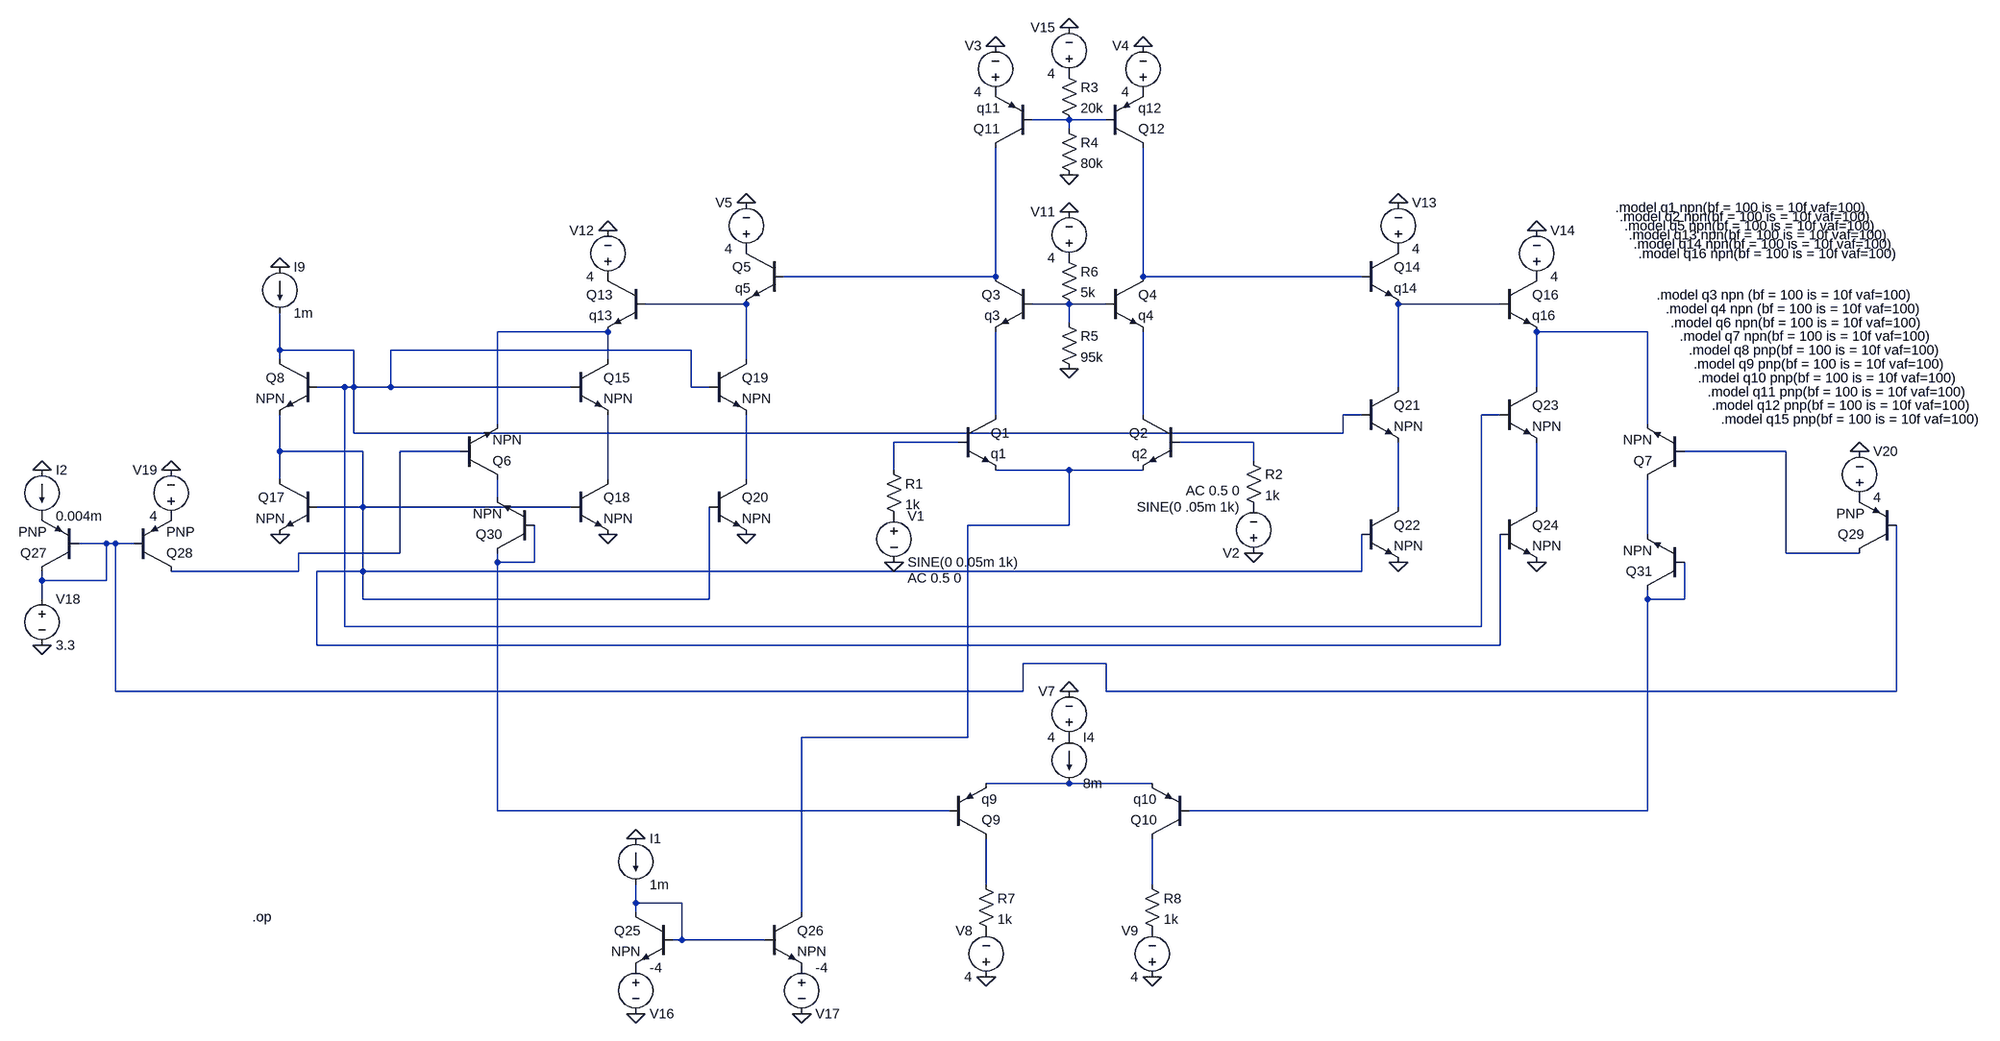
[diagram p0: schematic part_b.asc]
part_b.asc, the LTspice schematic file:
Version 4
SHEET 1 1848 1604
WIRE 128 -288 64 -288
WIRE 192 -288 128 -288
WIRE 128 -272 128 -288
WIRE 0 -16 0 -240
WIRE 0 -16 -368 -16
WIRE 256 -16 256 -240
WIRE 720 -16 256 -16
WIRE -432 32 -608 32
WIRE 128 32 64 32
WIRE 192 32 128 32
WIRE 960 32 784 32
WIRE 128 64 128 32
WIRE -672 80 -864 80
WIRE 1216 80 1024 80
WIRE -1296 112 -1296 48
WIRE -1168 112 -1296 112
WIRE -528 112 -1104 112
WIRE -1296 128 -1296 112
WIRE -672 128 -672 80
WIRE -432 128 -432 32
WIRE -1184 176 -1232 176
WIRE -1168 176 -1168 112
WIRE -1168 176 -1184 176
WIRE -1104 176 -1104 112
WIRE -1104 176 -1168 176
WIRE -736 176 -1104 176
WIRE -528 176 -528 112
WIRE -496 176 -528 176
WIRE 784 176 784 32
WIRE 1024 176 1024 80
WIRE 0 224 0 80
WIRE 256 224 256 80
WIRE 720 224 688 224
WIRE 960 224 928 224
WIRE -864 240 -864 80
WIRE 1216 240 1216 80
WIRE -1168 256 -1168 176
WIRE 688 256 688 224
WIRE 688 256 -1168 256
WIRE -64 272 -176 272
WIRE 448 272 320 272
WIRE -1296 288 -1296 224
WIRE -1152 288 -1296 288
WIRE -928 288 -1088 288
WIRE 1456 288 1280 288
WIRE 448 304 448 272
WIRE -176 320 -176 272
WIRE 128 320 0 320
WIRE 256 320 128 320
WIRE -1296 336 -1296 288
WIRE -672 336 -672 224
WIRE -432 336 -432 224
WIRE -864 368 -864 336
WIRE -1152 384 -1152 288
WIRE -1152 384 -1232 384
WIRE -736 384 -1152 384
WIRE 784 384 784 272
WIRE 1024 384 1024 272
WIRE 128 416 128 320
WIRE 128 416 -48 416
WIRE 1216 432 1216 336
WIRE -1632 448 -1680 448
WIRE -1616 448 -1632 448
WIRE -1584 448 -1616 448
WIRE -1088 464 -1088 288
WIRE -1088 464 -1264 464
WIRE 1456 464 1456 288
WIRE 1584 464 1456 464
WIRE -864 480 -864 464
WIRE -800 480 -800 416
WIRE -800 480 -864 480
WIRE -1264 496 -1264 464
WIRE -1264 496 -1520 496
WIRE -1152 496 -1152 384
WIRE -1152 496 -1232 496
WIRE 720 496 720 432
WIRE 720 496 -1152 496
WIRE -1744 512 -1744 496
WIRE -1632 512 -1632 448
WIRE -1632 512 -1744 512
WIRE -1744 544 -1744 512
WIRE -1152 544 -1152 496
WIRE -496 544 -496 384
WIRE -496 544 -1152 544
WIRE 1216 544 1216 528
WIRE 1280 544 1280 480
WIRE 1280 544 1216 544
WIRE -1184 592 -1184 176
WIRE 928 592 928 224
WIRE 928 592 -1184 592
WIRE -1232 624 -1232 496
WIRE 960 624 960 432
WIRE 960 624 -1232 624
WIRE 192 656 48 656
WIRE -1616 704 -1616 448
WIRE 48 704 48 656
WIRE 48 704 -1616 704
WIRE 192 704 192 656
WIRE 1648 704 1648 416
WIRE 1648 704 192 704
WIRE -48 784 -48 416
WIRE -48 784 -336 784
WIRE 128 864 -16 864
WIRE 272 864 128 864
WIRE -864 912 -864 480
WIRE -80 912 -864 912
WIRE 1216 912 1216 544
WIRE 1216 912 336 912
WIRE -16 1040 -16 960
WIRE 272 1040 272 960
WIRE -624 1072 -624 1040
WIRE -544 1072 -624 1072
WIRE -624 1088 -624 1072
WIRE -336 1088 -336 784
WIRE -544 1136 -544 1072
WIRE -544 1136 -560 1136
WIRE -400 1136 -544 1136
FLAG 256 -416 0
FLAG 0 -416 0
FLAG -432 -144 0
FLAG -16 1200 0
FLAG 272 1200 0
FLAG -672 -96 0
FLAG 784 -144 0
FLAG 1024 -96 0
FLAG 128 -192 0
FLAG 128 -128 0
FLAG 128 144 0
FLAG 128 -448 0
FLAG -176 480 0
FLAG 448 464 0
FLAG -1296 -32 0
FLAG -1296 432 0
FLAG -672 432 0
FLAG -432 432 0
FLAG 784 480 0
FLAG 1024 480 0
FLAG -624 960 0
FLAG -624 1264 0
FLAG -336 1264 0
FLAG -1744 320 0
FLAG -1520 320 0
FLAG -1744 624 0
FLAG 1584 288 0
FLAG 128 704 0
DATAFLAG -208 912 ""
DATAFLAG -16 992 ""
DATAFLAG 272 1008 ""
DATAFLAG 96 864 ""
DATAFLAG 96 320 ""
DATAFLAG -336 1008 ""
DATAFLAG -480 1136 ""
DATAFLAG -1440 496 ""
DATAFLAG -1616 448 ""
DATAFLAG 1504 464 ""
DATAFLAG 1680 416 ""
SYMBOL res -192 304 R0
SYMATTR InstName R1
SYMATTR Value 1k
SYMBOL res 432 288 R0
SYMATTR InstName R2
SYMATTR Value 1k
SYMBOL npn -64 224 R0
SYMATTR InstName Q1
SYMATTR Value q1
SYMBOL npn 320 224 M0
SYMATTR InstName Q2
SYMATTR Value q2
SYMBOL voltage 0 -320 R180
WINDOW 0 24 96 Left 2
WINDOW 3 24 16 Left 2
WINDOW 123 0 0 Left 0
WINDOW 39 0 0 Left 0
SYMATTR InstName V3
SYMATTR Value 4
SYMBOL voltage 256 -320 R180
WINDOW 0 24 96 Left 2
WINDOW 3 24 16 Left 2
WINDOW 123 0 0 Left 0
WINDOW 39 0 0 Left 0
SYMATTR InstName V4
SYMATTR Value 4
SYMBOL npn -368 -64 M0
SYMATTR InstName Q5
SYMATTR Value q5
SYMBOL voltage -432 -48 R180
WINDOW 0 24 96 Left 2
WINDOW 3 24 16 Left 2
WINDOW 123 0 0 Left 0
WINDOW 39 0 0 Left 0
SYMATTR InstName V5
SYMATTR Value 4
SYMBOL current 128 784 R0
WINDOW 123 0 0 Left 0
WINDOW 39 0 0 Left 0
SYMATTR InstName I4
SYMATTR Value 8m
SYMBOL pnp -80 960 M180
SYMATTR InstName Q9
SYMATTR Value q9
SYMBOL pnp 336 960 R180
SYMATTR InstName Q10
SYMATTR Value q10
SYMBOL res -32 1024 R0
SYMATTR InstName R7
SYMATTR Value 1k
SYMBOL res 256 1024 R0
SYMATTR InstName R8
SYMATTR Value 1k
SYMBOL voltage -16 1216 R180
WINDOW 0 24 96 Left 2
WINDOW 3 24 16 Left 2
WINDOW 123 0 0 Left 0
WINDOW 39 0 0 Left 0
SYMATTR InstName V8
SYMATTR Value 4
SYMBOL voltage 272 1216 R180
WINDOW 0 24 96 Left 2
WINDOW 3 24 16 Left 2
WINDOW 123 0 0 Left 0
WINDOW 39 0 0 Left 0
SYMATTR InstName V9
SYMATTR Value 4
SYMBOL pnp 64 -240 R180
SYMATTR InstName Q11
SYMATTR Value q11
SYMBOL pnp 192 -240 M180
SYMATTR InstName Q12
SYMATTR Value q12
SYMBOL npn -608 -16 M0
SYMATTR InstName Q13
SYMATTR Value q13
SYMBOL voltage -672 0 R180
WINDOW 0 24 96 Left 2
WINDOW 3 24 16 Left 2
WINDOW 123 0 0 Left 0
WINDOW 39 0 0 Left 0
SYMATTR InstName V12
SYMATTR Value 4
SYMBOL npn 720 -64 R0
SYMATTR InstName Q14
SYMATTR Value q14
SYMBOL voltage 784 -48 M180
WINDOW 0 24 96 Left 2
WINDOW 3 24 16 Left 2
WINDOW 123 0 0 Left 0
WINDOW 39 0 0 Left 0
SYMATTR InstName V13
SYMATTR Value 4
SYMBOL npn 960 -16 R0
SYMATTR InstName Q16
SYMATTR Value q16
SYMBOL voltage 1024 0 M180
WINDOW 0 24 96 Left 2
WINDOW 3 24 16 Left 2
WINDOW 123 0 0 Left 0
WINDOW 39 0 0 Left 0
SYMATTR InstName V14
SYMATTR Value 4
SYMBOL res 112 -384 R0
SYMATTR InstName R3
SYMATTR Value 20k
SYMBOL res 112 -288 R0
SYMATTR InstName R4
SYMATTR Value 80k
SYMBOL res 112 48 R0
SYMATTR InstName R5
SYMATTR Value 95k
SYMBOL res 112 -64 R0
SYMATTR InstName R6
SYMATTR Value 5k
SYMBOL voltage 128 -32 R180
WINDOW 0 24 96 Left 2
WINDOW 3 24 16 Left 2
WINDOW 123 0 0 Left 0
WINDOW 39 0 0 Left 0
SYMATTR InstName V11
SYMATTR Value 4
SYMBOL voltage 128 -352 R180
WINDOW 0 24 96 Left 2
WINDOW 3 24 16 Left 2
SYMATTR InstName V15
SYMATTR Value 4
SYMBOL npn 64 -16 M0
SYMATTR InstName Q3
SYMATTR Value q3
SYMBOL npn 192 -16 R0
SYMATTR InstName Q4
SYMATTR Value q4
SYMBOL npn -928 336 M180
SYMATTR InstName Q6
SYMBOL npn 1280 336 R180
SYMATTR InstName Q7
SYMBOL voltage -176 384 R0
WINDOW 123 24 124 Left 2
WINDOW 39 0 0 Left 0
SYMATTR Value2 AC 0.5 0
SYMATTR InstName V1
SYMATTR Value SINE(0 0.05m 1k)
SYMBOL voltage 448 480 R180
WINDOW 123 24 124 Left 2
WINDOW 39 0 0 Left 0
SYMATTR Value2 AC 0.5 0
SYMATTR InstName V2
SYMATTR Value SINE(0 .05m 1k)
SYMBOL current -1296 -32 R0
WINDOW 123 0 0 Left 0
WINDOW 39 0 0 Left 0
SYMATTR InstName I9
SYMATTR Value 1m
SYMBOL npn -1232 128 M0
SYMATTR InstName Q8
SYMBOL npn -736 128 R0
SYMATTR InstName Q15
SYMBOL npn -1232 336 M0
SYMATTR InstName Q17
SYMBOL npn -736 336 R0
SYMATTR InstName Q18
SYMBOL npn -496 128 R0
SYMATTR InstName Q19
SYMBOL npn -496 336 R0
SYMATTR InstName Q20
SYMBOL npn 720 176 R0
SYMATTR InstName Q21
SYMBOL npn 720 384 R0
SYMATTR InstName Q22
SYMBOL npn 960 176 R0
SYMATTR InstName Q23
SYMBOL npn 960 384 R0
SYMATTR InstName Q24
SYMBOL current -624 960 R0
WINDOW 123 0 0 Left 0
WINDOW 39 0 0 Left 0
SYMATTR InstName I1
SYMATTR Value 1m
SYMBOL npn -560 1088 M0
SYMATTR InstName Q25
SYMBOL npn -400 1088 R0
SYMATTR InstName Q26
SYMBOL voltage -624 1168 R0
WINDOW 0 24 96 Left 2
WINDOW 3 24 16 Left 2
WINDOW 123 0 0 Left 0
WINDOW 39 0 0 Left 0
SYMATTR InstName V16
SYMATTR Value -4
SYMBOL voltage -336 1168 R0
WINDOW 0 24 96 Left 2
WINDOW 3 24 16 Left 2
WINDOW 123 0 0 Left 0
WINDOW 39 0 0 Left 0
SYMATTR InstName V17
SYMATTR Value -4
SYMBOL pnp -1680 496 R180
SYMATTR InstName Q27
SYMBOL pnp -1584 496 M180
SYMATTR InstName Q28
SYMBOL voltage -1520 416 R180
WINDOW 0 24 96 Left 2
WINDOW 3 24 16 Left 2
WINDOW 123 0 0 Left 0
WINDOW 39 0 0 Left 0
SYMATTR InstName V19
SYMATTR Value 4
SYMBOL current -1744 320 R0
WINDOW 123 0 0 Left 0
WINDOW 39 0 0 Left 0
SYMATTR InstName I2
SYMATTR Value 0.004m
SYMBOL voltage -1744 528 R0
WINDOW 123 0 0 Left 0
WINDOW 39 0 0 Left 0
SYMATTR InstName V18
SYMATTR Value 3.3
SYMBOL pnp 1648 464 R180
SYMATTR InstName Q29
SYMBOL voltage 1584 384 M180
WINDOW 0 24 96 Left 2
WINDOW 3 24 16 Left 2
WINDOW 123 0 0 Left 0
WINDOW 39 0 0 Left 0
SYMATTR InstName V20
SYMATTR Value 4
SYMBOL voltage 128 800 R180
WINDOW 0 24 96 Left 2
WINDOW 3 24 16 Left 2
WINDOW 123 0 0 Left 0
WINDOW 39 0 0 Left 0
SYMATTR InstName V7
SYMATTR Value 4
SYMBOL npn -800 464 R180
SYMATTR InstName Q30
SYMBOL npn 1280 528 R180
SYMATTR InstName Q31
TEXT 1160 -136 Left 2 !.model q1 npn(bf = 100 is = 10f vaf=100)
TEXT 1168 -120 Left 2 !.model q2 npn(bf = 100 is = 10f vaf=100)
TEXT 1176 -104 Left 2 !.model q5 npn(bf = 100 is = 10f vaf=100)
TEXT 1184 -88 Left 2 !.model q13 npn(bf = 100 is = 10f vaf=100)
TEXT 1192 -72 Left 2 !.model q14 npn(bf = 100 is = 10f vaf=100)
TEXT 1200 -56 Left 2 !.model q16 npn(bf = 100 is = 10f vaf=100)
TEXT 1232 16 Left 2 !.model q3 npn (bf = 100 is = 10f vaf=100)
TEXT 1248 40 Left 2 !.model q4 npn (bf = 100 is = 10f vaf=100)
TEXT 1256 64 Left 2 !.model q6 npn(bf = 100 is = 10f vaf=100)
TEXT 1272 88 Left 2 !.model q7 npn(bf = 100 is = 10f vaf=100)
TEXT 1288 112 Left 2 !.model q8 pnp(bf = 100 is = 10f vaf=100)
TEXT 1296 136 Left 2 !.model q9 pnp(bf = 100 is = 10f vaf=100)
TEXT 1304 160 Left 2 !.model q10 pnp(bf = 100 is = 10f vaf=100)
TEXT 1320 184 Left 2 !.model q11 pnp(bf = 100 is = 10f vaf=100)
TEXT 1328 208 Left 2 !.model q12 pnp(bf = 100 is = 10f vaf=100)
TEXT 1344 232 Left 2 !.model q15 pnp(bf = 100 is = 10f vaf=100)
TEXT -1344 1096 Left 2 !.op

The netlist it stands for:
* part_b.asc
R1 N012 P001 1k
R2 N013 P002 1k
Q1 N010 N012 N017 0 q1
Q2 N011 N013 N017 0 q2
V3 P003 0 4
V4 P004 0 4
Q5 P005 N002 N004 0 q5
V5 P005 0 4
I4 P006 N027 8m
Q9 N028 N025 N027 0 q9
Q10 N029 N026 N027 0 q10
R7 N028 P007 1k
R8 N029 P008 1k
V8 0 P007 4
V9 0 P008 4
Q11 N002 N001 P003 0 q11
Q12 N003 N001 P004 0 q12
Q13 P009 N004 N007 0 q13
V12 P009 0 4
Q14 P010 N003 N006 0 q14
V13 P010 0 4
Q16 P011 N006 N008 0 q16
V14 P011 0 4
R3 P012 N001 20k
R4 N001 0 80k
R5 N005 0 95k
R6 P013 N005 5k
V11 P013 0 4
V15 P012 0 4
Q3 N002 N005 N010 0 q3
Q4 N003 N005 N011 0 q4
Q6 N020 N015 N007 0 NPN
Q7 N023 N016 N008 0 NPN
V1 P001 0 SINE(0 0.05m 1k) AC 0.5 0
V2 0 P002 SINE(0 .05m 1k) AC 0.5 0
I9 0 N009 1m
Q8 N009 N009 N014 0 NPN
Q15 N007 N009 N018 0 NPN
Q17 N014 N014 0 0 NPN
Q18 N018 N014 0 0 NPN
Q19 N004 N009 N019 0 NPN
Q20 N019 N014 0 0 NPN
Q21 N006 N009 N021 0 NPN
Q22 N021 N014 0 0 NPN
Q23 N008 N009 N022 0 NPN
Q24 N022 N014 0 0 NPN
I1 0 N030 1m
Q25 N030 N030 P014 0 NPN
Q26 N017 N030 P015 0 NPN
V16 P014 0 -4
V17 P015 0 -4
Q27 N024 N024 P016 0 PNP
Q28 N015 N024 P017 0 PNP
V19 P017 0 4
I2 0 P016 0.004m
V18 N024 0 3.3
Q29 N016 N024 P018 0 PNP
V20 P018 0 4
V7 P006 0 4
Q30 N025 N025 N020 0 NPN
Q31 N026 N026 N023 0 NPN
.model NPN NPN
.model PNP PNP
.lib standard.bjt
.model q1 npn(bf = 100 is = 10f vaf=100)
.model q2 npn(bf = 100 is = 10f vaf=100)
.model q5 npn(bf = 100 is = 10f vaf=100)
.model q13 npn(bf = 100 is = 10f vaf=100)
.model q14 npn(bf = 100 is = 10f vaf=100)
.model q16 npn(bf = 100 is = 10f vaf=100)
.model q3 npn (bf = 100 is = 10f vaf=100)
.model q4 npn (bf = 100 is = 10f vaf=100)
.model q6 npn(bf = 100 is = 10f vaf=100)
.model q7 npn(bf = 100 is = 10f vaf=100)
.model q8 pnp(bf = 100 is = 10f vaf=100)
.model q9 pnp(bf = 100 is = 10f vaf=100)
.model q10 pnp(bf = 100 is = 10f vaf=100)
.model q11 pnp(bf = 100 is = 10f vaf=100)
.model q12 pnp(bf = 100 is = 10f vaf=100)
.model q15 pnp(bf = 100 is = 10f vaf=100)
.op
.backanno
.end